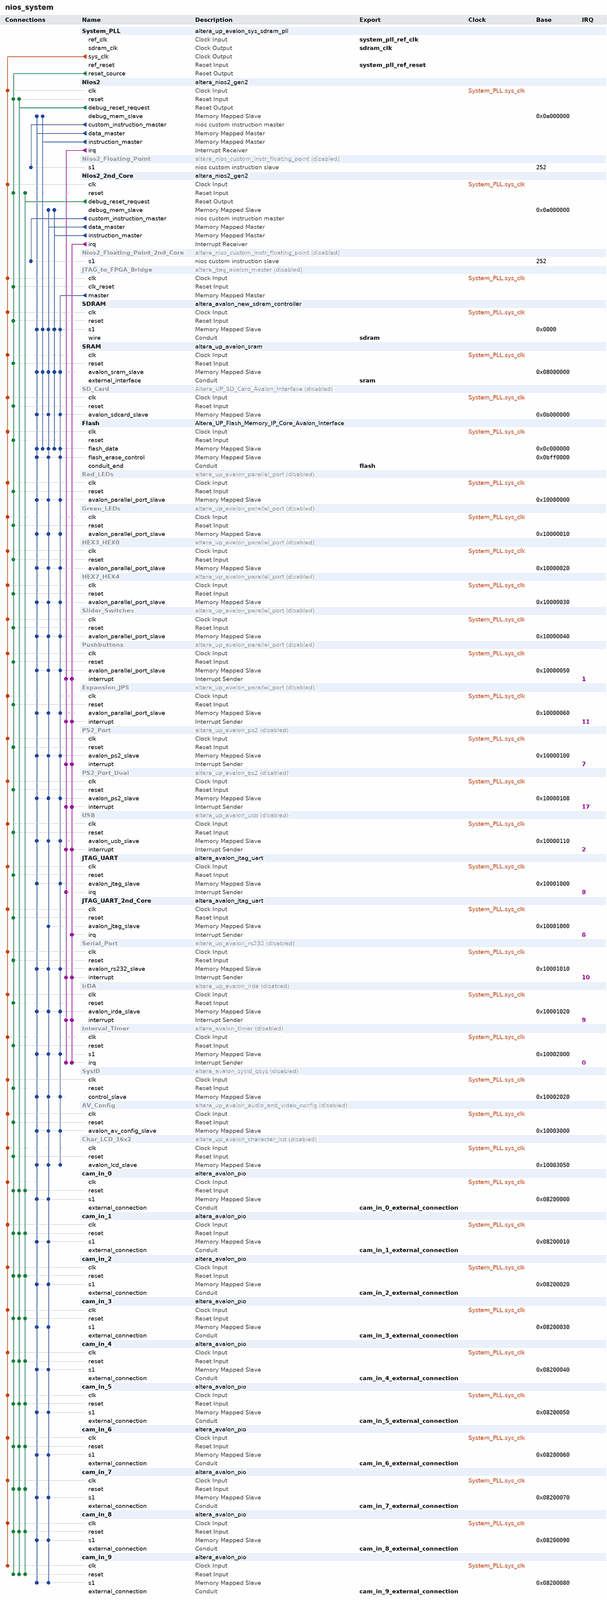
[diagram p0: system contents, whole]
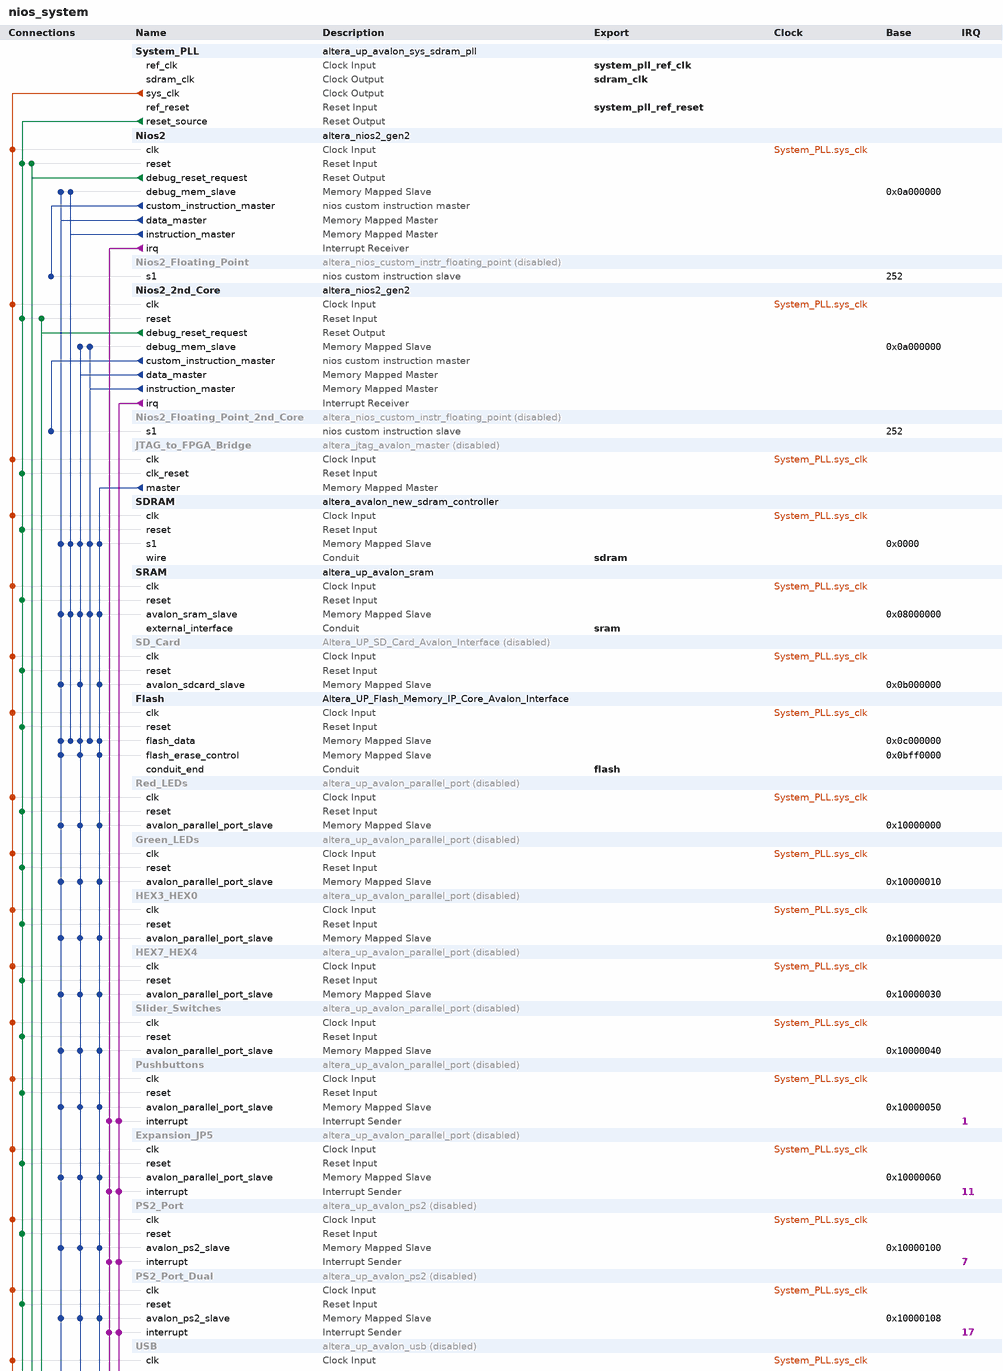
[diagram p1: system contents, upper part]
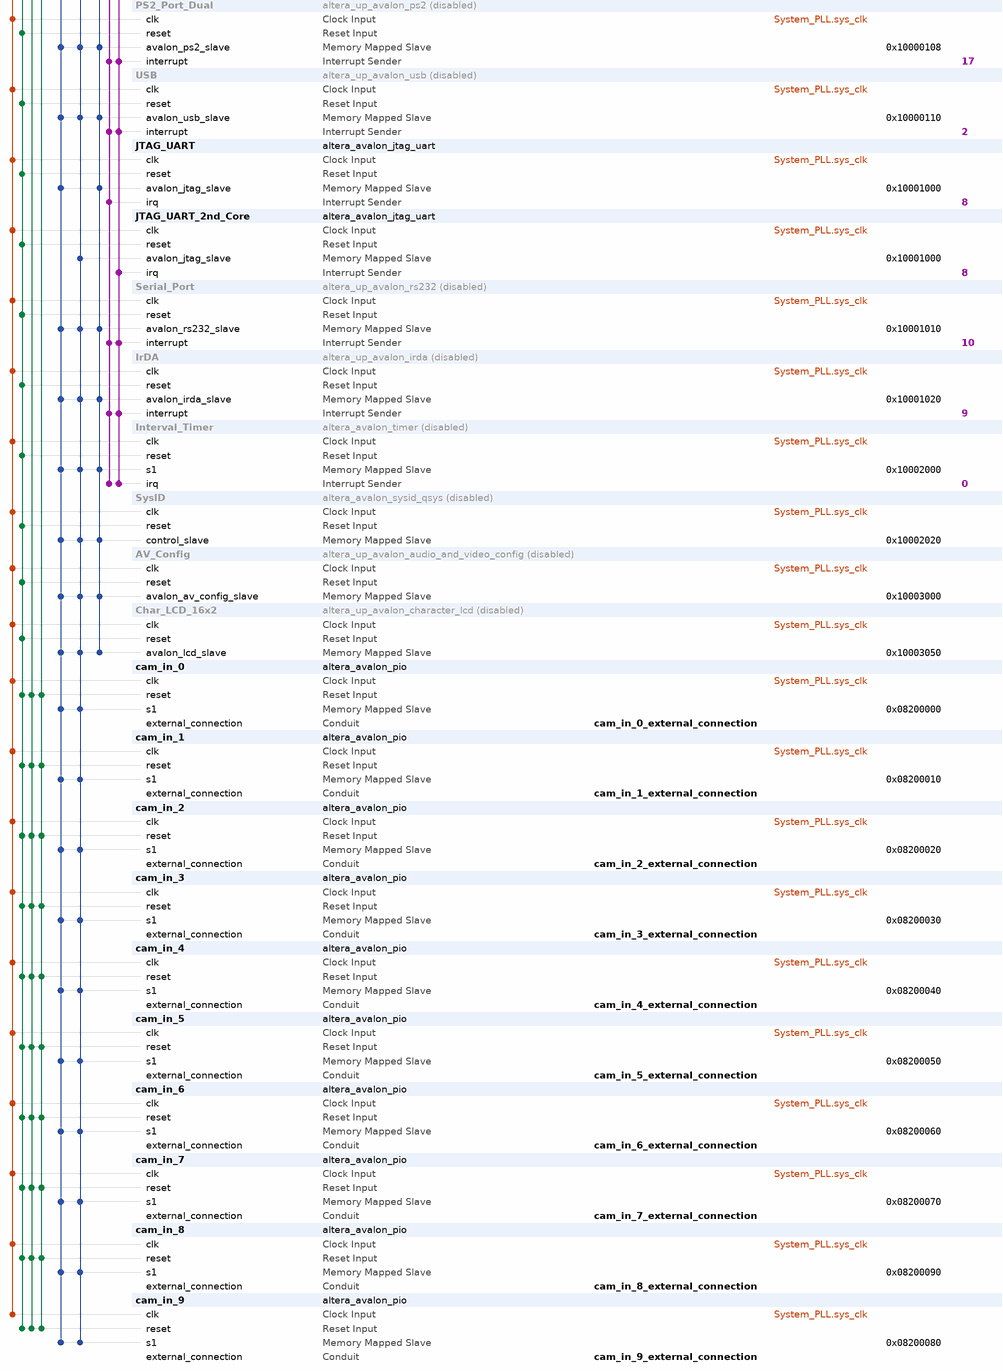
[diagram p2: system contents, lower part]
# Platform Designer (Qsys) system nios_system, Cyclone IV E EP4CE115F29C7
# Parameters at their usual value, and those the tool derives, are not listed.
package require -exact qsys 16.1
create_system nios_system
set_project_property DEVICE_FAMILY {Cyclone IV E}
set_project_property DEVICE EP4CE115F29C7

add_instance System_PLL altera_up_avalon_sys_sdram_pll 16.1
set_instance_parameter_value System_PLL CV_boards DE1-SoC
set_instance_parameter_value System_PLL gui_outclk 50.0
set_instance_parameter_value System_PLL gui_refclk 50.0

add_instance Nios2 altera_nios2_gen2 16.1
set_instance_parameter_value Nios2 dcache_size 0
set_instance_parameter_value Nios2 debug_datatrigger 2
set_instance_parameter_value Nios2 debug_hwbreakpoint 2
set_instance_parameter_value Nios2 debug_traceType instruction_trace
set_instance_parameter_value Nios2 dividerType srt2
set_instance_parameter_value Nios2 exceptionSlave SDRAM.s1
set_instance_parameter_value Nios2 icache_size 4096
set_instance_parameter_value Nios2 impl Fast
set_instance_parameter_value Nios2 mul_64_impl 1
set_instance_parameter_value Nios2 mul_shift_choice 1
set_instance_parameter_value Nios2 resetSlave SDRAM.s1
set_instance_parameter_value Nios2 resetrequest_enabled false

add_instance Nios2_Floating_Point altera_nios_custom_instr_floating_point 16.1
set_instance_property Nios2_Floating_Point ENABLED false

add_instance Nios2_2nd_Core altera_nios2_gen2 16.1
set_instance_parameter_value Nios2_2nd_Core cpuID 1
set_instance_parameter_value Nios2_2nd_Core dcache_size 0
set_instance_parameter_value Nios2_2nd_Core debug_datatrigger 2
set_instance_parameter_value Nios2_2nd_Core debug_hwbreakpoint 2
set_instance_parameter_value Nios2_2nd_Core debug_traceType instruction_trace
set_instance_parameter_value Nios2_2nd_Core dividerType srt2
set_instance_parameter_value Nios2_2nd_Core exceptionOffset 67108896
set_instance_parameter_value Nios2_2nd_Core exceptionSlave SDRAM.s1
set_instance_parameter_value Nios2_2nd_Core icache_size 4096
set_instance_parameter_value Nios2_2nd_Core impl Fast
set_instance_parameter_value Nios2_2nd_Core mul_64_impl 1
set_instance_parameter_value Nios2_2nd_Core mul_shift_choice 1
set_instance_parameter_value Nios2_2nd_Core resetOffset 67108864
set_instance_parameter_value Nios2_2nd_Core resetSlave SDRAM.s1
set_instance_parameter_value Nios2_2nd_Core resetrequest_enabled false

add_instance Nios2_Floating_Point_2nd_Core altera_nios_custom_instr_floating_point 16.1
set_instance_property Nios2_Floating_Point_2nd_Core ENABLED false

add_instance JTAG_to_FPGA_Bridge altera_jtag_avalon_master 16.1
set_instance_property JTAG_to_FPGA_Bridge ENABLED false

add_instance SDRAM altera_avalon_new_sdram_controller 16.1
set_instance_parameter_value SDRAM TAC 5.5
set_instance_parameter_value SDRAM TRCD 20.0
set_instance_parameter_value SDRAM TRP 20.0
set_instance_parameter_value SDRAM casLatency 3
set_instance_parameter_value SDRAM columnWidth 10
set_instance_parameter_value SDRAM dataWidth 32
set_instance_parameter_value SDRAM generateSimulationModel true
set_instance_parameter_value SDRAM model single_Micron_MT48LC4M32B2_7_chip
set_instance_parameter_value SDRAM numberOfBanks 4
set_instance_parameter_value SDRAM numberOfChipSelects 1
set_instance_parameter_value SDRAM powerUpDelay 100.0
set_instance_parameter_value SDRAM refreshPeriod 15.625
set_instance_parameter_value SDRAM rowWidth 13

add_instance SRAM altera_up_avalon_sram 16.1
set_instance_parameter_value SRAM board DE2-115
set_instance_parameter_value SRAM pixel_buffer true

add_instance SD_Card Altera_UP_SD_Card_Avalon_Interface 16.1
set_instance_property SD_Card ENABLED false

add_instance Flash Altera_UP_Flash_Memory_IP_Core_Avalon_Interface 16.1
set_instance_parameter_value Flash FLASH_MEMORY_ADDRESS_WIDTH 23

add_instance Red_LEDs altera_up_avalon_parallel_port 16.1
set_instance_property Red_LEDs ENABLED false
set_instance_parameter_value Red_LEDs board DE2-115
set_instance_parameter_value Red_LEDs capture false
set_instance_parameter_value Red_LEDs edge Rising
set_instance_parameter_value Red_LEDs irq false
set_instance_parameter_value Red_LEDs leds Red
set_instance_parameter_value Red_LEDs preset LEDs

add_instance Green_LEDs altera_up_avalon_parallel_port 16.1
set_instance_property Green_LEDs ENABLED false
set_instance_parameter_value Green_LEDs board DE2-115
set_instance_parameter_value Green_LEDs capture false
set_instance_parameter_value Green_LEDs edge Rising
set_instance_parameter_value Green_LEDs irq false
set_instance_parameter_value Green_LEDs preset LEDs

add_instance HEX3_HEX0 altera_up_avalon_parallel_port 16.1
set_instance_property HEX3_HEX0 ENABLED false
set_instance_parameter_value HEX3_HEX0 board DE2-115
set_instance_parameter_value HEX3_HEX0 capture false
set_instance_parameter_value HEX3_HEX0 edge Rising
set_instance_parameter_value HEX3_HEX0 irq false
set_instance_parameter_value HEX3_HEX0 preset {Seven Segment Displays}

add_instance HEX7_HEX4 altera_up_avalon_parallel_port 16.1
set_instance_property HEX7_HEX4 ENABLED false
set_instance_parameter_value HEX7_HEX4 board DE2-115
set_instance_parameter_value HEX7_HEX4 capture false
set_instance_parameter_value HEX7_HEX4 edge Rising
set_instance_parameter_value HEX7_HEX4 irq false
set_instance_parameter_value HEX7_HEX4 preset {Seven Segment Displays}
set_instance_parameter_value HEX7_HEX4 sevensegs {7 to 4}

add_instance Slider_Switches altera_up_avalon_parallel_port 16.1
set_instance_property Slider_Switches ENABLED false
set_instance_parameter_value Slider_Switches board DE2-115
set_instance_parameter_value Slider_Switches capture false
set_instance_parameter_value Slider_Switches edge Rising
set_instance_parameter_value Slider_Switches irq false
set_instance_parameter_value Slider_Switches preset {Slider Switches}

add_instance Pushbuttons altera_up_avalon_parallel_port 16.1
set_instance_property Pushbuttons ENABLED false
set_instance_parameter_value Pushbuttons board DE2-115
set_instance_parameter_value Pushbuttons capture true
set_instance_parameter_value Pushbuttons edge Falling
set_instance_parameter_value Pushbuttons irq true
set_instance_parameter_value Pushbuttons preset Pushbuttons

add_instance Expansion_JP5 altera_up_avalon_parallel_port 16.1
set_instance_property Expansion_JP5 ENABLED false
set_instance_parameter_value Expansion_JP5 board DE2-115
set_instance_parameter_value Expansion_JP5 capture true
set_instance_parameter_value Expansion_JP5 edge Falling
set_instance_parameter_value Expansion_JP5 irq true
set_instance_parameter_value Expansion_JP5 preset {Expansion Header}

add_instance PS2_Port altera_up_avalon_ps2 16.1
set_instance_property PS2_Port ENABLED false

add_instance PS2_Port_Dual altera_up_avalon_ps2 16.1
set_instance_property PS2_Port_Dual ENABLED false

add_instance USB altera_up_avalon_usb 16.1
set_instance_property USB ENABLED false

add_instance JTAG_UART altera_avalon_jtag_uart 16.1
set_instance_parameter_value JTAG_UART simInteractiveOptions NO_INTERACTIVE_WINDOWS

add_instance JTAG_UART_2nd_Core altera_avalon_jtag_uart 16.1
set_instance_parameter_value JTAG_UART_2nd_Core simInteractiveOptions NO_INTERACTIVE_WINDOWS

add_instance Serial_Port altera_up_avalon_rs232 16.1
set_instance_property Serial_Port ENABLED false
set_instance_parameter_value Serial_Port baud 115200
set_instance_parameter_value Serial_Port parity Odd

add_instance IrDA altera_up_avalon_irda 16.1
set_instance_property IrDA ENABLED false
set_instance_parameter_value IrDA baud 115200
set_instance_parameter_value IrDA clk_rate 50000000
set_instance_parameter_value IrDA parity None

add_instance Interval_Timer altera_avalon_timer 16.1
set_instance_property Interval_Timer ENABLED false
set_instance_parameter_value Interval_Timer period 125.0
set_instance_parameter_value Interval_Timer periodUnits MSEC

add_instance SysID altera_avalon_sysid_qsys 16.1
set_instance_property SysID ENABLED false
set_instance_parameter_value SysID id 0

add_instance AV_Config altera_up_avalon_audio_and_video_config 16.1
set_instance_property AV_Config ENABLED false
set_instance_parameter_value AV_Config audio_in {Microphone to ADC}
set_instance_parameter_value AV_Config bit_length 32
set_instance_parameter_value AV_Config board DE2-115
set_instance_parameter_value AV_Config line_in_bypass true
set_instance_parameter_value AV_Config sampling_rate {48 kHz}

add_instance Char_LCD_16x2 altera_up_avalon_character_lcd 16.1
set_instance_property Char_LCD_16x2 ENABLED false
set_instance_parameter_value Char_LCD_16x2 cursor Both

add_instance cam_in_0 altera_avalon_pio 16.1
set_instance_parameter_value cam_in_0 direction Input
set_instance_parameter_value cam_in_0 width 15

add_instance cam_in_1 altera_avalon_pio 16.1
set_instance_parameter_value cam_in_1 direction Input
set_instance_parameter_value cam_in_1 width 15

add_instance cam_in_2 altera_avalon_pio 16.1
set_instance_parameter_value cam_in_2 direction Input
set_instance_parameter_value cam_in_2 width 15

add_instance cam_in_3 altera_avalon_pio 16.1
set_instance_parameter_value cam_in_3 direction Input
set_instance_parameter_value cam_in_3 width 15

add_instance cam_in_4 altera_avalon_pio 16.1
set_instance_parameter_value cam_in_4 direction Input
set_instance_parameter_value cam_in_4 width 15

add_instance cam_in_5 altera_avalon_pio 16.1
set_instance_parameter_value cam_in_5 direction Input
set_instance_parameter_value cam_in_5 width 15

add_instance cam_in_6 altera_avalon_pio 16.1
set_instance_parameter_value cam_in_6 direction Input
set_instance_parameter_value cam_in_6 width 15

add_instance cam_in_7 altera_avalon_pio 16.1
set_instance_parameter_value cam_in_7 direction Input
set_instance_parameter_value cam_in_7 width 15

add_instance cam_in_8 altera_avalon_pio 16.1
set_instance_parameter_value cam_in_8 direction Input
set_instance_parameter_value cam_in_8 width 15

add_instance cam_in_9 altera_avalon_pio 16.1
set_instance_parameter_value cam_in_9 direction Input
set_instance_parameter_value cam_in_9 width 15

# connections
add_connection System_PLL.sys_clk AV_Config.clk clock
add_connection System_PLL.sys_clk cam_in_0.clk clock
add_connection System_PLL.sys_clk cam_in_1.clk clock
add_connection System_PLL.sys_clk cam_in_2.clk clock
add_connection System_PLL.sys_clk cam_in_3.clk clock
add_connection System_PLL.sys_clk cam_in_4.clk clock
add_connection System_PLL.sys_clk cam_in_5.clk clock
add_connection System_PLL.sys_clk cam_in_6.clk clock
add_connection System_PLL.sys_clk cam_in_7.clk clock
add_connection System_PLL.sys_clk cam_in_8.clk clock
add_connection System_PLL.sys_clk cam_in_9.clk clock
add_connection System_PLL.sys_clk Char_LCD_16x2.clk clock
add_connection System_PLL.sys_clk Expansion_JP5.clk clock
add_connection System_PLL.sys_clk Flash.clk clock
add_connection System_PLL.sys_clk Green_LEDs.clk clock
add_connection System_PLL.sys_clk HEX3_HEX0.clk clock
add_connection System_PLL.sys_clk HEX7_HEX4.clk clock
add_connection System_PLL.sys_clk Interval_Timer.clk clock
add_connection System_PLL.sys_clk IrDA.clk clock
add_connection System_PLL.sys_clk JTAG_to_FPGA_Bridge.clk clock
add_connection System_PLL.sys_clk JTAG_UART.clk clock
add_connection System_PLL.sys_clk JTAG_UART_2nd_Core.clk clock
add_connection System_PLL.sys_clk Nios2.clk clock
add_connection System_PLL.sys_clk Nios2_2nd_Core.clk clock
add_connection System_PLL.sys_clk PS2_Port.clk clock
add_connection System_PLL.sys_clk PS2_Port_Dual.clk clock
add_connection System_PLL.sys_clk Pushbuttons.clk clock
add_connection System_PLL.sys_clk Red_LEDs.clk clock
add_connection System_PLL.sys_clk SD_Card.clk clock
add_connection System_PLL.sys_clk SDRAM.clk clock
add_connection System_PLL.sys_clk Serial_Port.clk clock
add_connection System_PLL.sys_clk Slider_Switches.clk clock
add_connection System_PLL.sys_clk SRAM.clk clock
add_connection System_PLL.sys_clk SysID.clk clock
add_connection System_PLL.sys_clk USB.clk clock
add_connection Nios2.debug_reset_request cam_in_0.reset reset
add_connection Nios2.debug_reset_request cam_in_1.reset reset
add_connection Nios2.debug_reset_request cam_in_2.reset reset
add_connection Nios2.debug_reset_request cam_in_3.reset reset
add_connection Nios2.debug_reset_request cam_in_4.reset reset
add_connection Nios2.debug_reset_request cam_in_5.reset reset
add_connection Nios2.debug_reset_request cam_in_6.reset reset
add_connection Nios2.debug_reset_request cam_in_7.reset reset
add_connection Nios2.debug_reset_request cam_in_8.reset reset
add_connection Nios2.debug_reset_request cam_in_9.reset reset
add_connection Nios2.debug_reset_request Nios2.reset reset
add_connection Nios2_2nd_Core.debug_reset_request cam_in_0.reset reset
add_connection Nios2_2nd_Core.debug_reset_request cam_in_1.reset reset
add_connection Nios2_2nd_Core.debug_reset_request cam_in_2.reset reset
add_connection Nios2_2nd_Core.debug_reset_request cam_in_3.reset reset
add_connection Nios2_2nd_Core.debug_reset_request cam_in_4.reset reset
add_connection Nios2_2nd_Core.debug_reset_request cam_in_5.reset reset
add_connection Nios2_2nd_Core.debug_reset_request cam_in_6.reset reset
add_connection Nios2_2nd_Core.debug_reset_request cam_in_7.reset reset
add_connection Nios2_2nd_Core.debug_reset_request cam_in_8.reset reset
add_connection Nios2_2nd_Core.debug_reset_request cam_in_9.reset reset
add_connection Nios2_2nd_Core.debug_reset_request Nios2_2nd_Core.reset reset
add_connection System_PLL.reset_source AV_Config.reset reset
add_connection System_PLL.reset_source cam_in_0.reset reset
add_connection System_PLL.reset_source cam_in_1.reset reset
add_connection System_PLL.reset_source cam_in_2.reset reset
add_connection System_PLL.reset_source cam_in_3.reset reset
add_connection System_PLL.reset_source cam_in_4.reset reset
add_connection System_PLL.reset_source cam_in_5.reset reset
add_connection System_PLL.reset_source cam_in_6.reset reset
add_connection System_PLL.reset_source cam_in_7.reset reset
add_connection System_PLL.reset_source cam_in_8.reset reset
add_connection System_PLL.reset_source cam_in_9.reset reset
add_connection System_PLL.reset_source Char_LCD_16x2.reset reset
add_connection System_PLL.reset_source Expansion_JP5.reset reset
add_connection System_PLL.reset_source Flash.reset reset
add_connection System_PLL.reset_source Green_LEDs.reset reset
add_connection System_PLL.reset_source HEX3_HEX0.reset reset
add_connection System_PLL.reset_source HEX7_HEX4.reset reset
add_connection System_PLL.reset_source Interval_Timer.reset reset
add_connection System_PLL.reset_source IrDA.reset reset
add_connection System_PLL.reset_source JTAG_to_FPGA_Bridge.clk_reset reset
add_connection System_PLL.reset_source JTAG_UART.reset reset
add_connection System_PLL.reset_source JTAG_UART_2nd_Core.reset reset
add_connection System_PLL.reset_source Nios2.reset reset
add_connection System_PLL.reset_source Nios2_2nd_Core.reset reset
add_connection System_PLL.reset_source PS2_Port.reset reset
add_connection System_PLL.reset_source PS2_Port_Dual.reset reset
add_connection System_PLL.reset_source Pushbuttons.reset reset
add_connection System_PLL.reset_source Red_LEDs.reset reset
add_connection System_PLL.reset_source SD_Card.reset reset
add_connection System_PLL.reset_source SDRAM.reset reset
add_connection System_PLL.reset_source Serial_Port.reset reset
add_connection System_PLL.reset_source Slider_Switches.reset reset
add_connection System_PLL.reset_source SRAM.reset reset
add_connection System_PLL.reset_source SysID.reset reset
add_connection System_PLL.reset_source USB.reset reset
add_connection JTAG_to_FPGA_Bridge.master AV_Config.avalon_av_config_slave avalon
set_connection_parameter_value JTAG_to_FPGA_Bridge.master/AV_Config.avalon_av_config_slave baseAddress 0x10003000
add_connection JTAG_to_FPGA_Bridge.master Char_LCD_16x2.avalon_lcd_slave avalon
set_connection_parameter_value JTAG_to_FPGA_Bridge.master/Char_LCD_16x2.avalon_lcd_slave baseAddress 0x10003050
add_connection JTAG_to_FPGA_Bridge.master Expansion_JP5.avalon_parallel_port_slave avalon
set_connection_parameter_value JTAG_to_FPGA_Bridge.master/Expansion_JP5.avalon_parallel_port_slave baseAddress 0x10000060
add_connection JTAG_to_FPGA_Bridge.master Flash.flash_data avalon
set_connection_parameter_value JTAG_to_FPGA_Bridge.master/Flash.flash_data baseAddress 0x0c000000
add_connection JTAG_to_FPGA_Bridge.master Flash.flash_erase_control avalon
set_connection_parameter_value JTAG_to_FPGA_Bridge.master/Flash.flash_erase_control baseAddress 0x0bff0000
add_connection JTAG_to_FPGA_Bridge.master Green_LEDs.avalon_parallel_port_slave avalon
set_connection_parameter_value JTAG_to_FPGA_Bridge.master/Green_LEDs.avalon_parallel_port_slave baseAddress 0x10000010
add_connection JTAG_to_FPGA_Bridge.master HEX3_HEX0.avalon_parallel_port_slave avalon
set_connection_parameter_value JTAG_to_FPGA_Bridge.master/HEX3_HEX0.avalon_parallel_port_slave baseAddress 0x10000020
add_connection JTAG_to_FPGA_Bridge.master HEX7_HEX4.avalon_parallel_port_slave avalon
set_connection_parameter_value JTAG_to_FPGA_Bridge.master/HEX7_HEX4.avalon_parallel_port_slave baseAddress 0x10000030
add_connection JTAG_to_FPGA_Bridge.master Interval_Timer.s1 avalon
set_connection_parameter_value JTAG_to_FPGA_Bridge.master/Interval_Timer.s1 baseAddress 0x10002000
add_connection JTAG_to_FPGA_Bridge.master IrDA.avalon_irda_slave avalon
set_connection_parameter_value JTAG_to_FPGA_Bridge.master/IrDA.avalon_irda_slave baseAddress 0x10001020
add_connection JTAG_to_FPGA_Bridge.master JTAG_UART.avalon_jtag_slave avalon
set_connection_parameter_value JTAG_to_FPGA_Bridge.master/JTAG_UART.avalon_jtag_slave baseAddress 0x10001000
add_connection JTAG_to_FPGA_Bridge.master PS2_Port.avalon_ps2_slave avalon
set_connection_parameter_value JTAG_to_FPGA_Bridge.master/PS2_Port.avalon_ps2_slave baseAddress 0x10000100
add_connection JTAG_to_FPGA_Bridge.master PS2_Port_Dual.avalon_ps2_slave avalon
set_connection_parameter_value JTAG_to_FPGA_Bridge.master/PS2_Port_Dual.avalon_ps2_slave baseAddress 0x10000108
add_connection JTAG_to_FPGA_Bridge.master Pushbuttons.avalon_parallel_port_slave avalon
set_connection_parameter_value JTAG_to_FPGA_Bridge.master/Pushbuttons.avalon_parallel_port_slave baseAddress 0x10000050
add_connection JTAG_to_FPGA_Bridge.master Red_LEDs.avalon_parallel_port_slave avalon
set_connection_parameter_value JTAG_to_FPGA_Bridge.master/Red_LEDs.avalon_parallel_port_slave baseAddress 0x10000000
add_connection JTAG_to_FPGA_Bridge.master SD_Card.avalon_sdcard_slave avalon
set_connection_parameter_value JTAG_to_FPGA_Bridge.master/SD_Card.avalon_sdcard_slave baseAddress 0x0b000000
add_connection JTAG_to_FPGA_Bridge.master SDRAM.s1 avalon
set_connection_parameter_value JTAG_to_FPGA_Bridge.master/SDRAM.s1 baseAddress 0x0000
add_connection JTAG_to_FPGA_Bridge.master Serial_Port.avalon_rs232_slave avalon
set_connection_parameter_value JTAG_to_FPGA_Bridge.master/Serial_Port.avalon_rs232_slave baseAddress 0x10001010
add_connection JTAG_to_FPGA_Bridge.master Slider_Switches.avalon_parallel_port_slave avalon
set_connection_parameter_value JTAG_to_FPGA_Bridge.master/Slider_Switches.avalon_parallel_port_slave baseAddress 0x10000040
add_connection JTAG_to_FPGA_Bridge.master SRAM.avalon_sram_slave avalon
set_connection_parameter_value JTAG_to_FPGA_Bridge.master/SRAM.avalon_sram_slave baseAddress 0x08000000
add_connection JTAG_to_FPGA_Bridge.master SysID.control_slave avalon
set_connection_parameter_value JTAG_to_FPGA_Bridge.master/SysID.control_slave baseAddress 0x10002020
add_connection JTAG_to_FPGA_Bridge.master USB.avalon_usb_slave avalon
set_connection_parameter_value JTAG_to_FPGA_Bridge.master/USB.avalon_usb_slave baseAddress 0x10000110
add_connection Nios2.data_master AV_Config.avalon_av_config_slave avalon
set_connection_parameter_value Nios2.data_master/AV_Config.avalon_av_config_slave baseAddress 0x10003000
add_connection Nios2.data_master cam_in_0.s1 avalon
set_connection_parameter_value Nios2.data_master/cam_in_0.s1 baseAddress 0x08200000
add_connection Nios2.data_master cam_in_1.s1 avalon
set_connection_parameter_value Nios2.data_master/cam_in_1.s1 baseAddress 0x08200010
add_connection Nios2.data_master cam_in_2.s1 avalon
set_connection_parameter_value Nios2.data_master/cam_in_2.s1 baseAddress 0x08200020
add_connection Nios2.data_master cam_in_3.s1 avalon
set_connection_parameter_value Nios2.data_master/cam_in_3.s1 baseAddress 0x08200030
add_connection Nios2.data_master cam_in_4.s1 avalon
set_connection_parameter_value Nios2.data_master/cam_in_4.s1 baseAddress 0x08200040
add_connection Nios2.data_master cam_in_5.s1 avalon
set_connection_parameter_value Nios2.data_master/cam_in_5.s1 baseAddress 0x08200050
add_connection Nios2.data_master cam_in_6.s1 avalon
set_connection_parameter_value Nios2.data_master/cam_in_6.s1 baseAddress 0x08200060
add_connection Nios2.data_master cam_in_7.s1 avalon
set_connection_parameter_value Nios2.data_master/cam_in_7.s1 baseAddress 0x08200070
add_connection Nios2.data_master cam_in_8.s1 avalon
set_connection_parameter_value Nios2.data_master/cam_in_8.s1 baseAddress 0x08200090
add_connection Nios2.data_master cam_in_9.s1 avalon
set_connection_parameter_value Nios2.data_master/cam_in_9.s1 baseAddress 0x08200080
add_connection Nios2.data_master Char_LCD_16x2.avalon_lcd_slave avalon
set_connection_parameter_value Nios2.data_master/Char_LCD_16x2.avalon_lcd_slave baseAddress 0x10003050
add_connection Nios2.data_master Expansion_JP5.avalon_parallel_port_slave avalon
set_connection_parameter_value Nios2.data_master/Expansion_JP5.avalon_parallel_port_slave baseAddress 0x10000060
add_connection Nios2.data_master Flash.flash_data avalon
set_connection_parameter_value Nios2.data_master/Flash.flash_data baseAddress 0x0c000000
add_connection Nios2.data_master Flash.flash_erase_control avalon
set_connection_parameter_value Nios2.data_master/Flash.flash_erase_control baseAddress 0x0bff0000
add_connection Nios2.data_master Green_LEDs.avalon_parallel_port_slave avalon
set_connection_parameter_value Nios2.data_master/Green_LEDs.avalon_parallel_port_slave baseAddress 0x10000010
add_connection Nios2.data_master HEX3_HEX0.avalon_parallel_port_slave avalon
set_connection_parameter_value Nios2.data_master/HEX3_HEX0.avalon_parallel_port_slave baseAddress 0x10000020
add_connection Nios2.data_master HEX7_HEX4.avalon_parallel_port_slave avalon
set_connection_parameter_value Nios2.data_master/HEX7_HEX4.avalon_parallel_port_slave baseAddress 0x10000030
add_connection Nios2.data_master Interval_Timer.s1 avalon
set_connection_parameter_value Nios2.data_master/Interval_Timer.s1 baseAddress 0x10002000
add_connection Nios2.data_master IrDA.avalon_irda_slave avalon
set_connection_parameter_value Nios2.data_master/IrDA.avalon_irda_slave baseAddress 0x10001020
add_connection Nios2.data_master JTAG_UART.avalon_jtag_slave avalon
set_connection_parameter_value Nios2.data_master/JTAG_UART.avalon_jtag_slave baseAddress 0x10001000
add_connection Nios2.data_master Nios2.debug_mem_slave avalon
set_connection_parameter_value Nios2.data_master/Nios2.debug_mem_slave baseAddress 0x0a000000
add_connection Nios2.data_master PS2_Port.avalon_ps2_slave avalon
set_connection_parameter_value Nios2.data_master/PS2_Port.avalon_ps2_slave baseAddress 0x10000100
add_connection Nios2.data_master PS2_Port_Dual.avalon_ps2_slave avalon
set_connection_parameter_value Nios2.data_master/PS2_Port_Dual.avalon_ps2_slave baseAddress 0x10000108
add_connection Nios2.data_master Pushbuttons.avalon_parallel_port_slave avalon
set_connection_parameter_value Nios2.data_master/Pushbuttons.avalon_parallel_port_slave baseAddress 0x10000050
add_connection Nios2.data_master Red_LEDs.avalon_parallel_port_slave avalon
set_connection_parameter_value Nios2.data_master/Red_LEDs.avalon_parallel_port_slave baseAddress 0x10000000
add_connection Nios2.data_master SD_Card.avalon_sdcard_slave avalon
set_connection_parameter_value Nios2.data_master/SD_Card.avalon_sdcard_slave baseAddress 0x0b000000
add_connection Nios2.data_master SDRAM.s1 avalon
set_connection_parameter_value Nios2.data_master/SDRAM.s1 baseAddress 0x0000
add_connection Nios2.data_master Serial_Port.avalon_rs232_slave avalon
set_connection_parameter_value Nios2.data_master/Serial_Port.avalon_rs232_slave baseAddress 0x10001010
add_connection Nios2.data_master Slider_Switches.avalon_parallel_port_slave avalon
set_connection_parameter_value Nios2.data_master/Slider_Switches.avalon_parallel_port_slave baseAddress 0x10000040
add_connection Nios2.data_master SRAM.avalon_sram_slave avalon
set_connection_parameter_value Nios2.data_master/SRAM.avalon_sram_slave baseAddress 0x08000000
add_connection Nios2.data_master SysID.control_slave avalon
set_connection_parameter_value Nios2.data_master/SysID.control_slave baseAddress 0x10002020
add_connection Nios2.data_master USB.avalon_usb_slave avalon
set_connection_parameter_value Nios2.data_master/USB.avalon_usb_slave baseAddress 0x10000110
add_connection Nios2.instruction_master Flash.flash_data avalon
set_connection_parameter_value Nios2.instruction_master/Flash.flash_data baseAddress 0x0c000000
add_connection Nios2.instruction_master Nios2.debug_mem_slave avalon
set_connection_parameter_value Nios2.instruction_master/Nios2.debug_mem_slave baseAddress 0x0a000000
add_connection Nios2.instruction_master SDRAM.s1 avalon
set_connection_parameter_value Nios2.instruction_master/SDRAM.s1 baseAddress 0x0000
add_connection Nios2.instruction_master SRAM.avalon_sram_slave avalon
set_connection_parameter_value Nios2.instruction_master/SRAM.avalon_sram_slave baseAddress 0x08000000
add_connection Nios2_2nd_Core.data_master AV_Config.avalon_av_config_slave avalon
set_connection_parameter_value Nios2_2nd_Core.data_master/AV_Config.avalon_av_config_slave baseAddress 0x10003000
add_connection Nios2_2nd_Core.data_master cam_in_0.s1 avalon
set_connection_parameter_value Nios2_2nd_Core.data_master/cam_in_0.s1 baseAddress 0x08200000
add_connection Nios2_2nd_Core.data_master cam_in_1.s1 avalon
set_connection_parameter_value Nios2_2nd_Core.data_master/cam_in_1.s1 baseAddress 0x08200010
add_connection Nios2_2nd_Core.data_master cam_in_2.s1 avalon
set_connection_parameter_value Nios2_2nd_Core.data_master/cam_in_2.s1 baseAddress 0x08200020
add_connection Nios2_2nd_Core.data_master cam_in_3.s1 avalon
set_connection_parameter_value Nios2_2nd_Core.data_master/cam_in_3.s1 baseAddress 0x08200030
add_connection Nios2_2nd_Core.data_master cam_in_4.s1 avalon
set_connection_parameter_value Nios2_2nd_Core.data_master/cam_in_4.s1 baseAddress 0x08200040
add_connection Nios2_2nd_Core.data_master cam_in_5.s1 avalon
set_connection_parameter_value Nios2_2nd_Core.data_master/cam_in_5.s1 baseAddress 0x08200050
add_connection Nios2_2nd_Core.data_master cam_in_6.s1 avalon
set_connection_parameter_value Nios2_2nd_Core.data_master/cam_in_6.s1 baseAddress 0x08200060
add_connection Nios2_2nd_Core.data_master cam_in_7.s1 avalon
set_connection_parameter_value Nios2_2nd_Core.data_master/cam_in_7.s1 baseAddress 0x08200070
add_connection Nios2_2nd_Core.data_master cam_in_8.s1 avalon
set_connection_parameter_value Nios2_2nd_Core.data_master/cam_in_8.s1 baseAddress 0x08200090
add_connection Nios2_2nd_Core.data_master cam_in_9.s1 avalon
set_connection_parameter_value Nios2_2nd_Core.data_master/cam_in_9.s1 baseAddress 0x08200080
add_connection Nios2_2nd_Core.data_master Char_LCD_16x2.avalon_lcd_slave avalon
set_connection_parameter_value Nios2_2nd_Core.data_master/Char_LCD_16x2.avalon_lcd_slave baseAddress 0x10003050
add_connection Nios2_2nd_Core.data_master Expansion_JP5.avalon_parallel_port_slave avalon
set_connection_parameter_value Nios2_2nd_Core.data_master/Expansion_JP5.avalon_parallel_port_slave baseAddress 0x10000060
add_connection Nios2_2nd_Core.data_master Flash.flash_data avalon
set_connection_parameter_value Nios2_2nd_Core.data_master/Flash.flash_data baseAddress 0x0c000000
add_connection Nios2_2nd_Core.data_master Flash.flash_erase_control avalon
set_connection_parameter_value Nios2_2nd_Core.data_master/Flash.flash_erase_control baseAddress 0x0bff0000
add_connection Nios2_2nd_Core.data_master Green_LEDs.avalon_parallel_port_slave avalon
set_connection_parameter_value Nios2_2nd_Core.data_master/Green_LEDs.avalon_parallel_port_slave baseAddress 0x10000010
add_connection Nios2_2nd_Core.data_master HEX3_HEX0.avalon_parallel_port_slave avalon
set_connection_parameter_value Nios2_2nd_Core.data_master/HEX3_HEX0.avalon_parallel_port_slave baseAddress 0x10000020
add_connection Nios2_2nd_Core.data_master HEX7_HEX4.avalon_parallel_port_slave avalon
set_connection_parameter_value Nios2_2nd_Core.data_master/HEX7_HEX4.avalon_parallel_port_slave baseAddress 0x10000030
add_connection Nios2_2nd_Core.data_master Interval_Timer.s1 avalon
set_connection_parameter_value Nios2_2nd_Core.data_master/Interval_Timer.s1 baseAddress 0x10002000
add_connection Nios2_2nd_Core.data_master IrDA.avalon_irda_slave avalon
set_connection_parameter_value Nios2_2nd_Core.data_master/IrDA.avalon_irda_slave baseAddress 0x10001020
add_connection Nios2_2nd_Core.data_master JTAG_UART_2nd_Core.avalon_jtag_slave avalon
set_connection_parameter_value Nios2_2nd_Core.data_master/JTAG_UART_2nd_Core.avalon_jtag_slave baseAddress 0x10001000
add_connection Nios2_2nd_Core.data_master Nios2_2nd_Core.debug_mem_slave avalon
set_connection_parameter_value Nios2_2nd_Core.data_master/Nios2_2nd_Core.debug_mem_slave baseAddress 0x0a000000
add_connection Nios2_2nd_Core.data_master PS2_Port.avalon_ps2_slave avalon
set_connection_parameter_value Nios2_2nd_Core.data_master/PS2_Port.avalon_ps2_slave baseAddress 0x10000100
add_connection Nios2_2nd_Core.data_master PS2_Port_Dual.avalon_ps2_slave avalon
set_connection_parameter_value Nios2_2nd_Core.data_master/PS2_Port_Dual.avalon_ps2_slave baseAddress 0x10000108
add_connection Nios2_2nd_Core.data_master Pushbuttons.avalon_parallel_port_slave avalon
set_connection_parameter_value Nios2_2nd_Core.data_master/Pushbuttons.avalon_parallel_port_slave baseAddress 0x10000050
add_connection Nios2_2nd_Core.data_master Red_LEDs.avalon_parallel_port_slave avalon
set_connection_parameter_value Nios2_2nd_Core.data_master/Red_LEDs.avalon_parallel_port_slave baseAddress 0x10000000
add_connection Nios2_2nd_Core.data_master SD_Card.avalon_sdcard_slave avalon
set_connection_parameter_value Nios2_2nd_Core.data_master/SD_Card.avalon_sdcard_slave baseAddress 0x0b000000
add_connection Nios2_2nd_Core.data_master SDRAM.s1 avalon
set_connection_parameter_value Nios2_2nd_Core.data_master/SDRAM.s1 baseAddress 0x0000
add_connection Nios2_2nd_Core.data_master Serial_Port.avalon_rs232_slave avalon
set_connection_parameter_value Nios2_2nd_Core.data_master/Serial_Port.avalon_rs232_slave baseAddress 0x10001010
add_connection Nios2_2nd_Core.data_master Slider_Switches.avalon_parallel_port_slave avalon
set_connection_parameter_value Nios2_2nd_Core.data_master/Slider_Switches.avalon_parallel_port_slave baseAddress 0x10000040
add_connection Nios2_2nd_Core.data_master SRAM.avalon_sram_slave avalon
set_connection_parameter_value Nios2_2nd_Core.data_master/SRAM.avalon_sram_slave baseAddress 0x08000000
add_connection Nios2_2nd_Core.data_master SysID.control_slave avalon
set_connection_parameter_value Nios2_2nd_Core.data_master/SysID.control_slave baseAddress 0x10002020
add_connection Nios2_2nd_Core.data_master USB.avalon_usb_slave avalon
set_connection_parameter_value Nios2_2nd_Core.data_master/USB.avalon_usb_slave baseAddress 0x10000110
add_connection Nios2_2nd_Core.instruction_master Flash.flash_data avalon
set_connection_parameter_value Nios2_2nd_Core.instruction_master/Flash.flash_data baseAddress 0x0c000000
add_connection Nios2_2nd_Core.instruction_master Nios2_2nd_Core.debug_mem_slave avalon
set_connection_parameter_value Nios2_2nd_Core.instruction_master/Nios2_2nd_Core.debug_mem_slave baseAddress 0x0a000000
add_connection Nios2_2nd_Core.instruction_master SDRAM.s1 avalon
set_connection_parameter_value Nios2_2nd_Core.instruction_master/SDRAM.s1 baseAddress 0x0000
add_connection Nios2_2nd_Core.instruction_master SRAM.avalon_sram_slave avalon
set_connection_parameter_value Nios2_2nd_Core.instruction_master/SRAM.avalon_sram_slave baseAddress 0x08000000
add_connection Nios2.irq Expansion_JP5.interrupt interrupt
set_connection_parameter_value Nios2.irq/Expansion_JP5.interrupt irqNumber 11
add_connection Nios2.irq Interval_Timer.irq interrupt
set_connection_parameter_value Nios2.irq/Interval_Timer.irq irqNumber 0
add_connection Nios2.irq IrDA.interrupt interrupt
set_connection_parameter_value Nios2.irq/IrDA.interrupt irqNumber 9
add_connection Nios2.irq JTAG_UART.irq interrupt
set_connection_parameter_value Nios2.irq/JTAG_UART.irq irqNumber 8
add_connection Nios2.irq PS2_Port.interrupt interrupt
set_connection_parameter_value Nios2.irq/PS2_Port.interrupt irqNumber 7
add_connection Nios2.irq PS2_Port_Dual.interrupt interrupt
set_connection_parameter_value Nios2.irq/PS2_Port_Dual.interrupt irqNumber 17
add_connection Nios2.irq Pushbuttons.interrupt interrupt
set_connection_parameter_value Nios2.irq/Pushbuttons.interrupt irqNumber 1
add_connection Nios2.irq Serial_Port.interrupt interrupt
set_connection_parameter_value Nios2.irq/Serial_Port.interrupt irqNumber 10
add_connection Nios2.irq USB.interrupt interrupt
set_connection_parameter_value Nios2.irq/USB.interrupt irqNumber 2
add_connection Nios2_2nd_Core.irq Expansion_JP5.interrupt interrupt
set_connection_parameter_value Nios2_2nd_Core.irq/Expansion_JP5.interrupt irqNumber 11
add_connection Nios2_2nd_Core.irq Interval_Timer.irq interrupt
set_connection_parameter_value Nios2_2nd_Core.irq/Interval_Timer.irq irqNumber 0
add_connection Nios2_2nd_Core.irq IrDA.interrupt interrupt
set_connection_parameter_value Nios2_2nd_Core.irq/IrDA.interrupt irqNumber 9
add_connection Nios2_2nd_Core.irq JTAG_UART_2nd_Core.irq interrupt
set_connection_parameter_value Nios2_2nd_Core.irq/JTAG_UART_2nd_Core.irq irqNumber 8
add_connection Nios2_2nd_Core.irq PS2_Port.interrupt interrupt
set_connection_parameter_value Nios2_2nd_Core.irq/PS2_Port.interrupt irqNumber 7
add_connection Nios2_2nd_Core.irq PS2_Port_Dual.interrupt interrupt
set_connection_parameter_value Nios2_2nd_Core.irq/PS2_Port_Dual.interrupt irqNumber 17
add_connection Nios2_2nd_Core.irq Pushbuttons.interrupt interrupt
set_connection_parameter_value Nios2_2nd_Core.irq/Pushbuttons.interrupt irqNumber 1
add_connection Nios2_2nd_Core.irq Serial_Port.interrupt interrupt
set_connection_parameter_value Nios2_2nd_Core.irq/Serial_Port.interrupt irqNumber 10
add_connection Nios2_2nd_Core.irq USB.interrupt interrupt
set_connection_parameter_value Nios2_2nd_Core.irq/USB.interrupt irqNumber 2
add_connection Nios2.custom_instruction_master Nios2_Floating_Point.s1 nios_custom_instruction
set_connection_parameter_value Nios2.custom_instruction_master/Nios2_Floating_Point.s1 CIName nios2_floating_point
set_connection_parameter_value Nios2.custom_instruction_master/Nios2_Floating_Point.s1 baseAddress 252
add_connection Nios2_2nd_Core.custom_instruction_master Nios2_Floating_Point_2nd_Core.s1 nios_custom_instruction
set_connection_parameter_value Nios2_2nd_Core.custom_instruction_master/Nios2_Floating_Point_2nd_Core.s1 CIName nios2_floating_point_2nd_core
set_connection_parameter_value Nios2_2nd_Core.custom_instruction_master/Nios2_Floating_Point_2nd_Core.s1 baseAddress 252

# exported interfaces
add_interface cam_in_0_external_connection conduit end
set_interface_property cam_in_0_external_connection EXPORT_OF cam_in_0.external_connection
add_interface cam_in_1_external_connection conduit end
set_interface_property cam_in_1_external_connection EXPORT_OF cam_in_1.external_connection
add_interface cam_in_2_external_connection conduit end
set_interface_property cam_in_2_external_connection EXPORT_OF cam_in_2.external_connection
add_interface cam_in_3_external_connection conduit end
set_interface_property cam_in_3_external_connection EXPORT_OF cam_in_3.external_connection
add_interface cam_in_4_external_connection conduit end
set_interface_property cam_in_4_external_connection EXPORT_OF cam_in_4.external_connection
add_interface cam_in_5_external_connection conduit end
set_interface_property cam_in_5_external_connection EXPORT_OF cam_in_5.external_connection
add_interface cam_in_6_external_connection conduit end
set_interface_property cam_in_6_external_connection EXPORT_OF cam_in_6.external_connection
add_interface cam_in_7_external_connection conduit end
set_interface_property cam_in_7_external_connection EXPORT_OF cam_in_7.external_connection
add_interface cam_in_8_external_connection conduit end
set_interface_property cam_in_8_external_connection EXPORT_OF cam_in_8.external_connection
add_interface cam_in_9_external_connection conduit end
set_interface_property cam_in_9_external_connection EXPORT_OF cam_in_9.external_connection
add_interface flash conduit end
set_interface_property flash EXPORT_OF Flash.conduit_end
add_interface sdram conduit end
set_interface_property sdram EXPORT_OF SDRAM.wire
add_interface sdram_clk clock source
set_interface_property sdram_clk EXPORT_OF System_PLL.sdram_clk
add_interface sram conduit end
set_interface_property sram EXPORT_OF SRAM.external_interface
add_interface system_pll_ref_clk clock sink
set_interface_property system_pll_ref_clk EXPORT_OF System_PLL.ref_clk
add_interface system_pll_ref_reset reset sink
set_interface_property system_pll_ref_reset EXPORT_OF System_PLL.ref_reset

set_interconnect_requirement {$system} qsys_mm.clockCrossingAdapter HANDSHAKE
set_interconnect_requirement {$system} qsys_mm.enableEccProtection FALSE
set_interconnect_requirement {$system} qsys_mm.insertDefaultSlave FALSE
set_interconnect_requirement {$system} qsys_mm.maxAdditionalLatency 1

save_system nios_system.qsys
